# EAGLE design lpc134x (EAGLE 5.12)
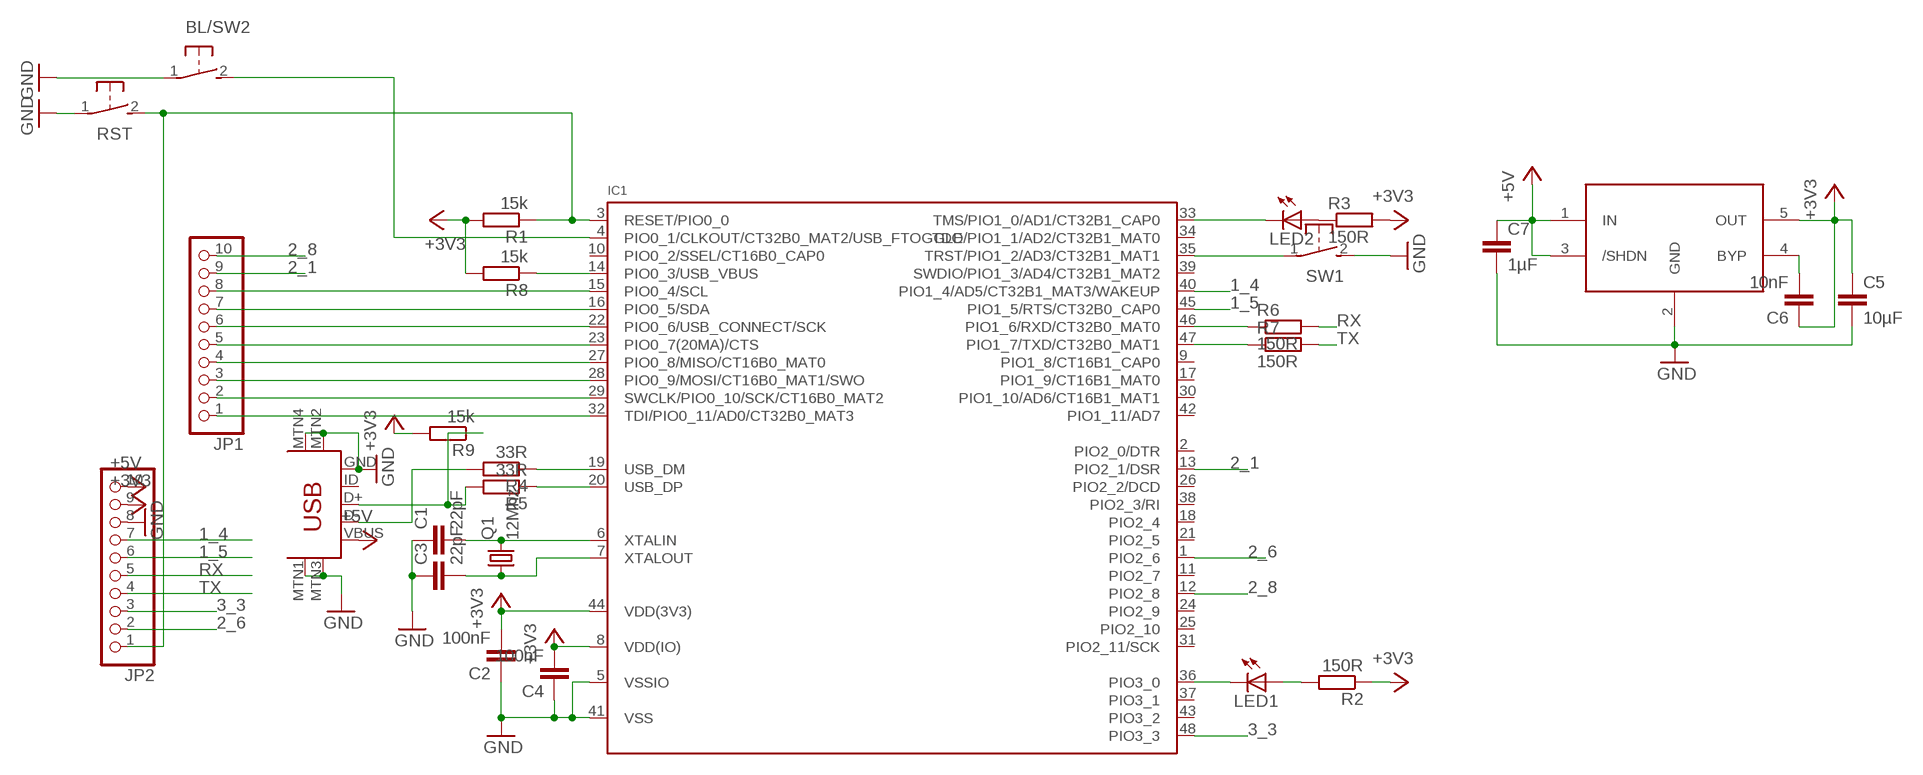
[diagram p0: schematic, sheet 1]

## Parts
BL/SW2  SWITCH_MCTAEF  [SWITCH_MCTAEF]
C1  22pF  C-EUC0402  [C0402]
C2  100nF  C-EUC0402  [C0402]
C3  22pF  C-EUC0402  [C0402]
C4  100nF  C-EUC0402  [C0402]
C5  10µF  CAP0805  [0805]
C6  10nF  C-EUC0402  [C0402]
C7  1µF  CAP0805  [0805]
IC1  LPC1343_QFP  [LQFP48]
IC2  LT1761  [SOT23-5L]
JP1  PINHD-1X10_2.54  [1X10]
JP2  PINHD-1X10_2.54  [1X10]
LED1  LEDCHIPLED_0805  [CHIPLED_0805]
LED2  LEDCHIPLED_0805  [CHIPLED_0805]
Q1  12Mhz  MT-OSCILLATOR  [MT]
R1  15k  R-EU_R0402  [R0402]
R2  150R  R-EU_R0402  [R0402]
R3  150R  R-EU_R0402  [R0402]
R4  33R  R-EU_R0402  [R0402]
R5  33R  R-EU_R0402  [R0402]
R6  150R  R-EU_R0402  [R0402]
R7  150R  R-EU_R0402  [R0402]
R8  15k  R-EU_R0402  [R0402]
R9  15k  R-EU_R0402  [R0402]
RST  SWITCH_MCTAEF  [SWITCH_MCTAEF]
SW1  SWITCH_MCTAEF  [SWITCH_MCTAEF]
U$1  USB-MINIB-5PIN  [USB-MINIB]

## Nets
1_4: IC1.40(PIO1_4/AD5/CT32B1_MAT3/WAKEUP) JP2.7
1_5: IC1.45(PIO1_5/RTS/CT32B0_CAP0) JP2.6
2_1: IC1.13(PIO2_1/DSR) JP1.9
2_6: IC1.1(PIO2_6) JP2.2
2_8: IC1.12(PIO2_8) JP1.10
3_3: IC1.48(PIO3_3) JP2.3
+3V3: C2.2 C4.2 C5.1 C6.1 IC1.8(VDD(IO)) IC1.44(VDD(3V3)) IC2.5(OUT) JP2.9 R1.2 R2.1 R3.2 R8.2 R9.2
+5V: C7.1 IC2.1(IN) IC2.3(/SHDN) JP2.10 U$1.VBUS
GND: BL/SW2.1 C1.1 C2.1 C3.1 C4.1 C5.2 C7.2 IC1.5(VSSIO) IC1.41(VSS) IC2.2(GND) JP2.8 RST.1 SW1.2 U$1.GND U$1.MTN1(MTN2) U$1.MTN2(MTN3) U$1.MTN3(MTN1) U$1.MTN4
N$1: IC1.32(TDI/PIO0_11/AD0/CT32B0_MAT3) JP1.1
N$2: IC1.29(SWCLK/PIO0_10/SCK/CT16B0_MAT2) JP1.2
N$3: C3.2 IC1.7(XTALOUT) Q1.1
N$4: C1.2 IC1.6(XTALIN) Q1.3
N$5: IC1.28(PIO0_9/MOSI/CT16B0_MAT1/SWO) JP1.3
N$6: IC1.27(PIO0_8/MISO/CT16B0_MAT0) JP1.4
N$7: IC1.3(RESET/PIO0_0) JP2.1 R1.1 RST.2
N$8: IC1.23(PIO0_7(20MA)/CTS) JP1.5
N$9: IC1.22(PIO0_6/USB_CONNECT/SCK) JP1.6
N$10: R5.2 R9.1 U$1.D+
N$11: R4.2 U$1.D-
N$12: IC1.14(PIO0_3/USB_VBUS) R8.1
N$14: IC1.19(USB_DM) R4.1
N$16: IC1.46(PIO1_6/RXD/CT32B0_MAT0) R6.1
N$17: IC1.47(PIO1_7/TXD/CT32B0_MAT1) R7.1
N$18: LED1.A R2.2
N$19: IC1.36(PIO3_0) LED1.C
N$20: IC1.35(TRST/PIO1_2/AD3/CT32B1_MAT1) SW1.1
N$21: BL/SW2.2 IC1.4(PIO0_1/CLKOUT/CT32B0_MAT2/USB_FTOGGLE)
N$22: LED2.A R3.1
N$23: IC1.33(TMS/PIO1_0/AD1/CT32B1_CAP0) LED2.C
N$24: IC1.20(USB_DP) R5.1
N$43: C6.2 IC2.4(BYP)
RX: JP2.5 R6.2
SCL: IC1.15(PIO0_4/SCL) JP1.8
SDA: IC1.16(PIO0_5/SDA) JP1.7
TX: JP2.4 R7.2
Unconnected: IC1.2(PIO2_0/DTR) IC1.9(PIO1_8/CT16B1_CAP0) IC1.10(PIO0_2/SSEL/CT16B0_CAP0) IC1.11(PIO2_7) IC1.17(PIO1_9/CT16B1_MAT0) IC1.18(PIO2_4) IC1.21(PIO2_5) IC1.24(PIO2_9) IC1.25(PIO2_10) IC1.26(PIO2_2/DCD) IC1.30(PIO1_10/AD6/CT16B1_MAT1) IC1.31(PIO2_11/SCK) IC1.34(TDO/PIO1_1/AD2/CT32B1_MAT0) IC1.37(PIO3_1) IC1.38(PIO2_3/RI) IC1.39(SWDIO/PIO1_3/AD4/CT32B1_MAT2) IC1.42(PIO1_11/AD7) IC1.43(PIO3_2) U$1.ID

## Library data of the parts
BL/SW2 RST SW1 = seb:SWITCH_MCTAEF
C1-C4 C6 = rcl:C-EU: CAPACITOR, European symbol
C5 C7 = SparkFun:CAP: Capacitor Standard 0603 ceramic capacitor, and 0.1" leaded capacitor.
IC1 = microbuilder:LPC1343_QFP: LPC1343 72 MHz 32-bit ARM Cortex-M3 microcontroller. 32 kB Flash, 8 kB SRAM, USB Device Mouser: 771-LPC1343FBD48151 Digikey: 568-4945-ND; DIGIKEY#: 568-4945-ND; MANF: NXP; MANF#: LPC1343FBD48,151
IC2 = seb:LT1761
JP1 JP2 = pinhead-2:PINHD-1X10: PIN HEADER
LED1 LED2 = led:LED: LED OSRAM: - CHIPLED LG R971, LG N971, LY N971, LG Q971, LY Q971, LO R971, LY R971 LH N974, LH R974 LS Q976, LO Q976, LY Q976 LO Q996 - Hyper CHIPLED LW Q18S LB Q993, LB Q99A, LB R99A - SideLED LS A670, LO A670, LY A670, LG A670, LP A670 LB A673, LV A673, LT A673, LW A673 LH A674 LY A675 LS A676, LA A676, LO A676, LY A676, LW A676 LS A679, LY A679, LG A679 - Hyper Micro SIDELED® LS Y876, LA Y876, LO Y876, LY Y876 LT Y87S - SmartLED LW L88C, LW L88S LB L89C, LB L89S, LG L890 LS L89K, LO L89K, LY L89K LS L896, LA L896, LO L896, LY L896 - TOPLED LS T670, LO T670, LY T670, LG T670, LP T670 LSG T670, LSP T670, LSY T670, LOP T670, LYG T670 LG T671, LOG T671, LSG T671 LB T673, LV T673, LT T673, LW T673 LH T674 LS T676, LA T676, LO T676, LY T676, LB T676, LH T676, LSB T676, LW T676 LB T67C, LV T67C, LT T67C, LS T67K, LO T67K, LY T67K, LW E67C LS E67B, LA E67B, LO E67B, LY E67B, LB E67C, LV E67C, LT E67C LW T67C LS T679, LY T679, LG T679 LS T770, LO T770, LY T770, LG T770, LP T770 LB T773, LV T773, LT T773, LW T773 LH T774 LS E675, LA E675, LY E675, LS T675 LS T776, LA T776, LO T776, LY T776, LB T776 LHGB T686 LT T68C, LB T68C - Hyper Mini TOPLED® LB M676 - Mini TOPLED Santana® LG M470 LS M47K, LO M47K, LY M47K Source: http://www.osram.convergy.de LUXEON: - LUMILED® LXK2-PW12-R00, LXK2-PW12-S00, LXK2-PW14-U00, LXK2-PW14-V00 LXK2-PM12-R00, LXK2-PM12-S00, LXK2-PM14-U00 LXK2-PE12-Q00, LXK2-PE12-R00, LXK2-PE12-S00, LXK2-PE14-T00, LXK2-PE14-U00 LXK2-PB12-K00, LXK2-PB12-L00, LXK2-PB12-M00, LXK2-PB14-N00, LXK2-PB14-P00, LXK2-PB14-Q00 LXK2-PR12-L00, LXK2-PR12-M00, LXK2-PR14-Q00, LXK2-PR14-R00 LXK2-PD12-Q00, LXK2-PD12-R00, LXK2-PD12-S00 LXK2-PH12-R00, LXK2-PH12-S00 LXK2-PL12-P00, LXK2-PL12-Q00, LXK2-PL12-R00 Source: www.luxeon.com KINGBRIGHT: KA-3528ASYC Source: www.kingbright.com
Q1 = seb:MT-OSCILLATOR
R1-R9 = rcl:R-EU_: RESISTOR, European symbol
U$1 = SparkFun:USB-MINIB: Mini-USB "B" connector with 5th pin broken out. Created new symbol breaking out 5th "ID" pin in mini/micro USB connector spec. See: http://en.wikipedia.org/wiki/Mini_usb#Cables. Uses same footprint as 4-pin symbol. Also added pins to connect to mounting / shield pads if required (probably not generally needed as signals aren't shielded once they leave the connector).

## Board
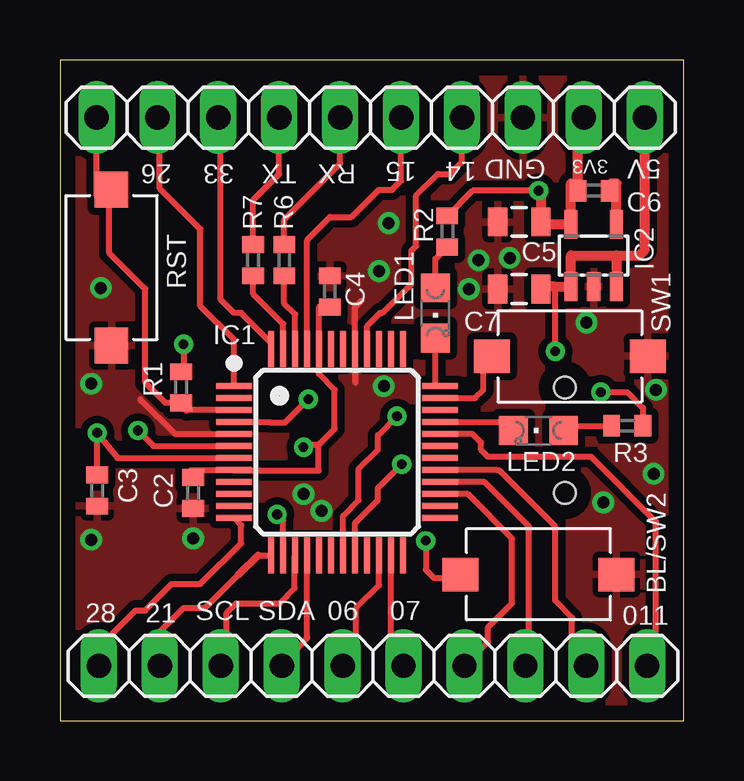
[diagram p1: board, top side]
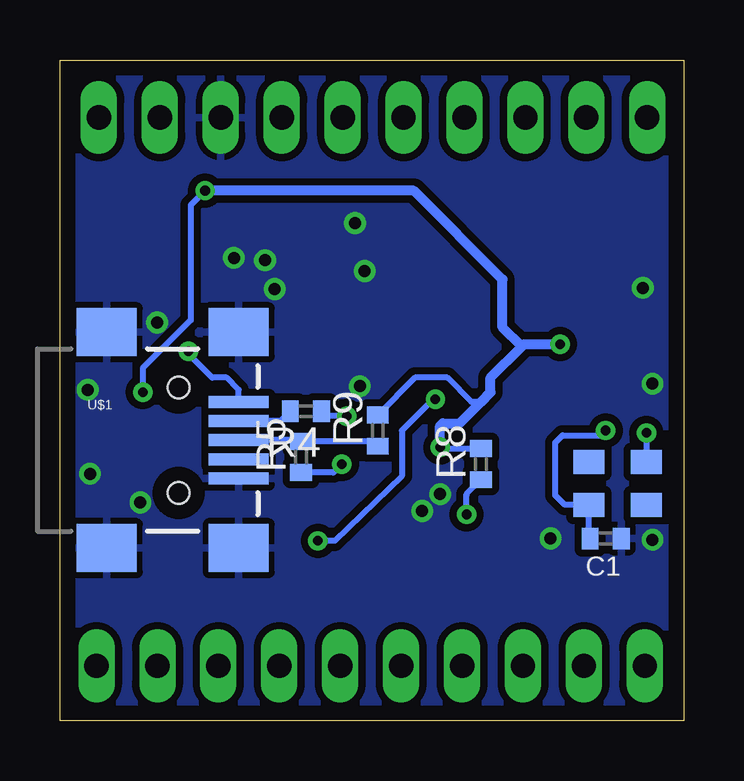
[diagram p2: board, bottom side, seen from below]

Size 26 x 27.55 mm. Coordinates in mm from the lower left corner, seen from the top.
Outline: 0,0 26,0 26,27.55 0,27.55 0,0
Copper layers (1*16): Top 0.035mm / dielectric 1.5mm / Bottom 0.035mm
Design rules "default *": minimum track width 10mil, minimum drill 24mil, track to track 8mil, track to pad 8mil, pad to pad 8mil, via to via 8mil, smd to smd 8mil, copper to edge 25mil, drill to drill 8mil, minimum pad ring 10mil, minimum via ring 8mil, stop-mask expansion 4mil, vias tented up to drill 40mil, thermal gap 10mil

### Footprints (pad centres in the part's own frame; a part is rotated, then mirrored left to right if it is on the bottom)
SWITCH_MCTAEF = smd 1.5 x 1.4: 1 -3.25,0; 2 3.25,0
C0402 = smd 0.7 x 0.9: 1 -0.65,0; 2 0.65,0
0805 = smd 0.8 x 1.2: 1 -0.9,0; 2 0.9,0
LQFP48 = smd 1.5 x 0.25: 1 -4.3,2.75; 2 -4.3,2.25; 3 -4.3,1.75; 4 -4.3,1.25; 5 -4.3,0.75; 6 -4.3,0.25; 7 -4.3,-0.25; 8 -4.3,-0.75; 9 -4.3,-1.25; 10 -4.3,-1.75; 11 -4.3,-2.25; 12 -4.3,-2.75; 25 4.3,-2.75; 26 4.3,-2.25; 27 4.3,-1.75; 28 4.3,-1.25; 29 4.3,-0.75; 30 4.3,-0.25; 31 4.3,0.25; 32 4.3,0.75; 33 4.3,1.25; 34 4.3,1.75; 35 4.3,2.25; 36 4.3,2.75 | smd 0.25 x 1.5: 13 -2.75,-4.3; 14 -2.25,-4.3; 15 -1.75,-4.3; 16 -1.25,-4.3; 17 -0.75,-4.3; 18 -0.25,-4.3; 19 0.25,-4.3; 20 0.75,-4.3; 21 1.25,-4.3; 22 1.75,-4.3; 23 2.25,-4.3; 24 2.75,-4.3; 37 2.75,4.3; 38 2.25,4.3; 39 1.75,4.3; 40 1.25,4.3; 41 0.75,4.3; 42 0.25,4.3; 43 -0.25,4.3; 44 -0.75,4.3; 45 -1.25,4.3; 46 -1.75,4.3; 47 -2.25,4.3; 48 -2.75,4.3
SOT23-5L = smd 0.55 x 1.2: 1 -0.95,-1.3; 2 0,-1.3; 3 0.95,-1.3; 4 0.95,1.3; 5 -0.95,1.3
1X10 = drill 1.016 long: 1 -11.43,0; 2 -8.89,0; 3 -6.35,0; 4 -3.81,0; 5 -1.27,0; 6 1.27,0; 7 3.81,0; 8 6.35,0; 9 8.89,0; 10 11.43,0
CHIPLED_0805 = smd 1.2 x 1.2: A 0,-1.05; C 0,1.05
MT = smd 1.3 x 1: 1 1.2,0.9; 2 -1.2,0.9; 3 -1.2,-0.9; 4 1.2,-0.9
R0402 = smd 0.7 x 0.9: 1 -0.65,0; 2 0.65,0
USB-MINIB = smd 2.5 x 0.5: D+ 2.5,0; D- 2.5,0.8; GND 2.5,-1.6; ID 2.5,-0.8; VBUS 2.5,1.6 | smd 2.5 x 2: MTN1 -3,4.5; MTN2 2.5,4.5; MTN3 -3,-4.5; MTN4 2.5,-4.5 | hole 0.9: 0,2.2; 0,-2.2

### Placement (x,y rotation side)
BL/SW2  19.95,6.1 180 top
C1  3.25,7.6 180 bottom
C2  5.55,9.5 90 top
C3  1.55,9.6 90 top
C4  11.25,17.9 270 top
C5  19.15,20.8 180 top
C6  22.25,22.1 0 top
C7  19.15,18 180 top
IC1  11.55,11.2 0 top
IC2  22.25,19.4 0 top
JP1  13.05,2.29 180 top
JP2  12.95,25.15 0 top
LED1  15.65,17 180 top
LED2  19.95,12.1 90 top
Q1  2.75,9.9 0 bottom
R1  5.05,13.9 90 top
R2  16.15,20.4 270 top
R3  23.65,12.3 0 top
R4  15.75,12.9 180 bottom
R5  15.95,11 90 bottom
R6  9.35,19.2 90 top
R7  8.05,19.2 90 top
R8  8.45,10.7 90 bottom
R9  12.75,12.1 90 bottom
RST  2.15,18.9 90 top
SW1  21.25,15.2 0 top
U$1  21.05,11.7 0 bottom

### Tracks (layer width: path | path; a pad name or v marks a point on that pad's centre or on a via)
1_4
  Top 0.254: JP2.7 16.76,23.31 16.25,22.8 15.75,22.8 14.85,21.9 14.85,19.8 14.65,19.6 14.65,18.2 13.45,17 13.35,17 12.8,16.45 IC1.40
1_5
  Top 0.254: JP2.6 14.22,22.51 13.85,22.14 13.29,22.14 12.15,21 11.25,21 10.3,20.05 10.3,20.01 IC1.45
2_1
  Top 0.254: JP1.9 4.16,3.71 5.15,4.7 6.05,4.7 7.45,6.1 | 8.25,6.9 IC1.13
  Top 0.305: 7.45,6.1 8.25,6.9
2_6
  Top 0.254: JP2.2 4.16,25.05 4.16,22.19 5.85,20.5 5.85,17.3 7.23,15.92 7.25,15.9 IC1.1
2_8
  Top 0.254: JP1.10 1.62,3.07 3.15,4.6 3.55,4.6 4.65,5.7 5.85,5.7 7.55,7.4 7.55,8.15 IC1.12
3_3
  Top 0.254: JP2.3 6.7,25.05 6.7,17.56 7.26,17 7.55,17 8.8,15.75 IC1.48
+3V3  (via drill 0.4)
  Top 0.254: 10.78,11.5 10.78,10.43 7.27,10.43 IC1.8 5.45,10.45 5.45,10.4 5.55,10.4 C2.2 | v10.15,11.4 10.25,11.5 10.78,11.5 | R1.2 5.15,14.55 v5.15,15.7 | R2.1 17.2,22.1 v19.95,22.1 | R3.2 24.3,13.05 23.65,13.7 v22.55,13.7 | 10.78,11.5 11.45,12.17 11.45,13.8 10.78,14.47 10.8,14.49 IC1.44 10.8,17.25 C4.2
  Top 0.406: JP2.9 21.6,24.91 C6.1 21.5,22.4 21.3,22.4 IC2.5 20.15,20.7 C5.1 20.05,22 v19.95,22.1
  Bottom 0.254: v22.55,13.7 22.55,14.7 20.55,16.7 20.55,21.5 v19.95,22.1 | R8.2 10.1,11.35 v10.15,11.4 | R9.2 11.2,14.3 9.85,14.3 8.85,13.3 8.45,13.3
  Bottom 0.406: 6.75,15.6 8.05,14.3 8.05,13.7 8.45,13.3 9.35,12.4 10.05,12.4 10.15,12.3 v10.15,11.4 | 6.75,15.6 6.65,15.7 v5.15,15.7 | v19.95,22.1 11.25,22.1 7.55,18.4 7.55,16.4 6.75,15.6
+5V  (via drill 0.4)
  Top 0.254: v20.65,15.4 20.65,18.1
  Top 0.406: 23.2,19.4 IC2.3 | 23.2,19.4 21.3,19.4 IC2.1 20.65,18.1 20.15,18.1 C7.1 | JP2.10 24.38,19.63 24.15,19.4 23.2,19.4
  Bottom 0.254: v20.65,15.4 20.65,15.3 19.65,14.3 19.05,14.3 18.55,13.8 U$1.VBUS
GND  (via drill 0.5)
  Top 0.254: 12.55,17.5 12.3,17.25 IC1.41 12.3,14.1 | IC1.5 4.8,11.95 3.35,13.4
  other vias: 10.15,9.45 1.3,7.55 5.55,7.6 22.65,9.1 24.75,10.3 21.95,16.6 18.75,19.3 17.45,19.2 17.05,18 1.7,18.05 1.3,14.05 13.3,18.75 13.7,20.75 13.5,13.95 10.9,8.75 24.85,13.8
  pour Top (isolate 0.305): 0,0.4 26,0.4 26,27.15 0,27.15
  pour Bottom (isolate 0.305): 0,0.4 26,0.4 26,27.15 0,27.15
N$1
  Top 0.254: JP1.1 24.85,3.26 24.85,8.3 22.15,11 17.85,11 17.55,11.3 17.55,11.6 17.22,11.93 17.2,11.95 IC1.32
N$2
  Top 0.254: JP1.2 21.35,2.99 21.35,4.3 20.65,5 20.65,8.1 18.32,10.43 18.2,10.45 IC1.29
N$3  (via drill 0.4)
  Top 0.254: IC1.7 2.4,10.95 v1.55,12 C3.2
  Bottom 0.254: v1.55,12 Q1.1
N$4  (via drill 0.4)
  Top 0.254: IC1.6 3.9,11.45 v3.25,12.1
  Bottom 0.254: v3.25,12.1 3.45,11.9 5.05,11.9 5.35,11.6 5.35,9.4 4.95,9 Q1.3 3.95,7.65 C1.2
N$5
  Top 0.254: JP1.3 19.55,2.25 19.55,8.1 17.72,9.93 17.7,9.95 IC1.28
N$6
  Top 0.254: JP1.4 17.85,3.28 17.85,3.9 18.85,4.9 18.85,7.6 17.02,9.43 17,9.45 IC1.27
N$7
  Top 0.254: R1.1 5.27,12.93 | JP2.1 1.52,21.88 2.05,21.95 2.05,19.5 3.55,18 3.55,14.1 4.4,13.25 R1.1 | IC1.3 5.35,12.95 R1.1
  Top 0.406: RST.2 2.05,22.15 2.05,21.95
N$8
  Top 0.254: JP1.5 13.78,2.94 13.8,2.96 IC1.23
N$9
  Top 0.254: JP1.6 12.35,2.97 12.35,4.7 13.28,5.63 13.3,5.65 IC1.22
N$10
  Bottom 0.254: U$1.D+ 16,11.7 R5.2 12.95,11.65 R9.1
N$11
  Bottom 0.254: U$1.D- 16.8,12.5 R4.2
N$12  (via drill 0.4)
  Top 0.254: IC1.14 9.3,8.35 v9.05,8.6
  Bottom 0.254: v9.05,8.6 9.05,9.4 9.05,9.45 R8.1
N$14  (via drill 0.4)
  Top 0.254: IC1.19 11.8,8.55 12.45,9.2 12.45,10.5 13.25,11.3 13.25,11.9 v14.05,12.7
  Bottom 0.254: v14.05,12.7 14.9,12.7 R4.1
N$16
  Top 0.254: IC1.46 9.8,16.95 9.35,17.4 R6.1
N$17
  Top 0.254: IC1.47 9.3,16.55 8.05,17.8 R7.1
N$18
  Top 0.254: R2.2 15.65,19.25 LED1.A
N$19
  Top 0.254: 15.83,15.63 LED1.C 15.65,13.95 IC1.36
N$20
  Top 0.254: 17.9,15.5 17.65,14.85 17.65,13.8 17.3,13.45 IC1.35
  Top 0.406: 17.9,15.5 18,15.5 SW1.1
N$21  (via drill 0.4)
  Top 0.254: v10.35,13.4 9.38,12.43 8.78,12.43 8.76,12.45 IC1.4 | 16.6,5.8 16.45,5.95 15.6,5.95 15.25,6.3 v15.25,7.5
  Top 0.406: BL/SW2.2 16.6,6.1 16.6,5.8
  Bottom 0.254: v10.35,13.4 10.45,13.4 11.75,12.1 11.75,10.2 14.55,7.5 v15.25,7.5
N$22
  Top 0.254: R3.1 21,12.3 LED2.A
N$23
  Top 0.254: 18.67,12.43 LED2.C 18.65,12.45 IC1.33
N$24  (via drill 0.4)
  Top 0.254: v14.25,10.7 13.25,9.7 13.25,9.2 12.45,8.4 12.3,8.25 IC1.20
  Bottom 0.254: R5.1 14.6,10.35 v14.25,10.7
N$43
  Top 0.406: IC2.4 23.2,22.4 23,22.4 C6.2
RX
  Top 0.254: JP2.5 11.68,23.23 9.35,20.9 R6.2
SCL
  Top 0.254: JP1.8 6.95,2.65 6.95,4.5 7.35,4.9 9.15,4.9 9.78,5.53 9.78,6.88 IC1.15
SDA
  Top 0.254: JP1.7 10.28,3.44 10.3,3.46 IC1.16
TX
  Top 0.254: JP2.4 9.14,22.79 8.05,21.7 R7.2

### Text on the board
tNames: 26 | 33 | TX | RX | 15 | 14 | GND | 3V3 | 5V | 28 | 21 | SCL | SDA | 06 | 07 | 011